# EAGLE design ESP8266_P10 (EAGLE 9.6.2)
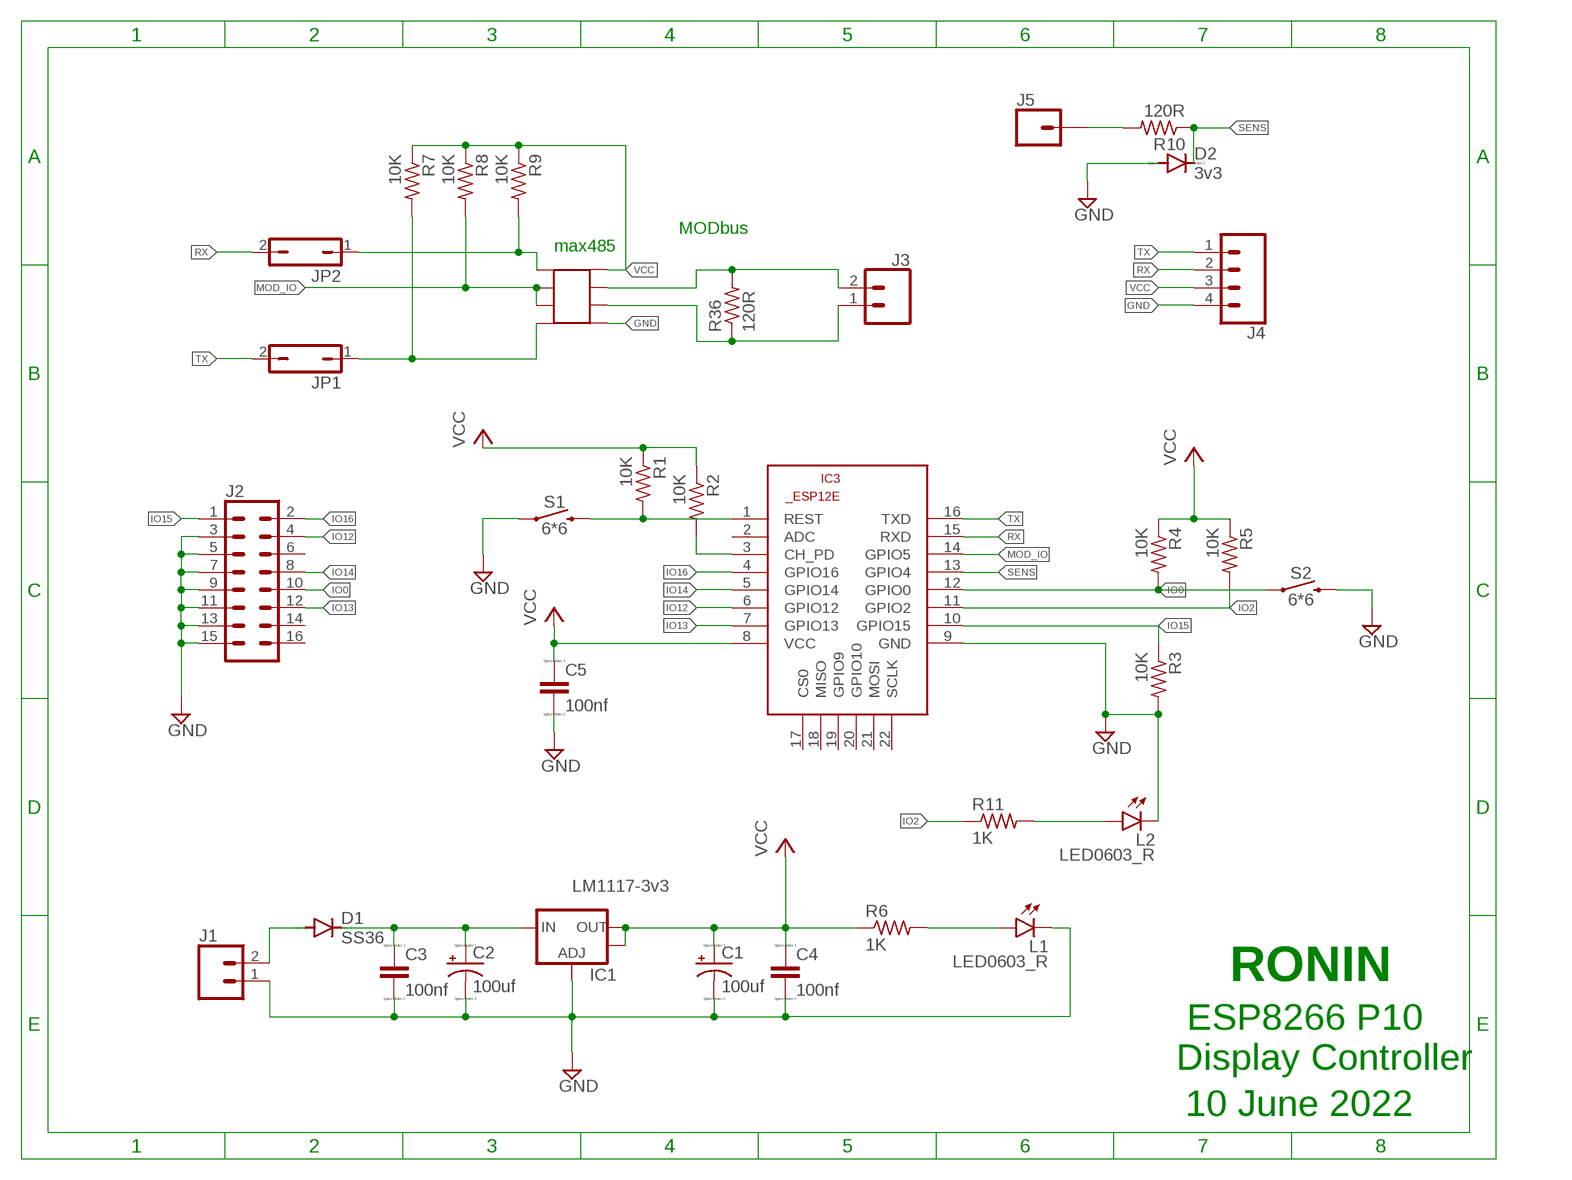
[diagram p0: schematic, sheet 1]

## Parts
C1  100uf  CAPACITOR_POLD  [PANASONIC_D]
C2  100uf  CAPACITOR_POLD  [PANASONIC_D]
C3  100nf  CAPACITOR_CER4  [C0603]
C4  100nf  CAPACITOR_CER4  [C0603]
C5  100nf  CAPACITOR_CER4  [C0603]
D1  SS36  DIODEAC2  [DO-214AC]
D2  3v3  DIODE80C  [SOD80C]
IC1  LM1117-3v3  V_REG_LM1117SOT223  [SOT223]
IC2  MAX485  SOP_8  [HSOP-8]
IC3  ESP8266-12EESP12E  [ESP8266-ESP12E]
J1  CONN_023.5MM  [SCREWTERMINAL-3.5MM-2]
J2  CONN_08X2  [2X8]
J3  CONN_023.5MM-NO_SILK  [SCREWTERMINAL-3.5MM-2-NS]
J4  CONN_04  [1X04]
J5  CONN_01  [1X01]
JP1  JP1Q  [JP1]
JP2  JP1Q  [JP1]
L1  LED0603_R  [0603_LED_GREEN]
L2  LED0603_R  [0603_LED_GREEN]
R1  10K  RESISTOR0603  [R0603]
R2  10K  RESISTOR0603  [R0603]
R3  10K  RESISTOR0603  [R0603]
R4  10K  RESISTOR0603  [R0603]
R5  10K  RESISTOR0603  [R0603]
R6  1K  RESISTOR0603  [R0603]
R7  10K  RESISTOR0603  [R0603]
R8  10K  RESISTOR0603  [R0603]
R9  10K  RESISTOR0603  [R0603]
R10  120R  RESISTOR0603  [R0603]
R11  1K  RESISTOR0603  [R0603]
R36  120R  RESISTOR0603  [R0603]
S1  6*6  MOMENTARY-SWITCH-SPST-PTH-6.0MM  [TACTILE_SWITCH_PTH_6.0MM]
S2  6*6  MOMENTARY-SWITCH-SPST-PTH-6.0MM  [TACTILE_SWITCH_PTH_6.0MM]

## Nets
CV: IC2.4 JP1.1 R7.2
FV: IC2.1 JP2.1 R9.2
GND: C1.- C2.- C3.2 C4.2 C5.2 D2.A IC1.1(ADJ) IC2.5 IC3.9(GND) J1.1 J2.3 J2.5 J2.7 J2.9 J2.11 J2.13 J2.15 J4.4 L1.C L2.C R3.2 S1.1 S2.3
IO0: IC3.12(GPIO0) J2.10 R4.2 S2.1
IO2: IC3.11(GPIO2) R5.2 R11.1
IO12: IC3.6(GPIO12) J2.4
IO13: IC3.7(GPIO13) J2.12
IO14: IC3.5(GPIO14) J2.8
IO15: IC3.10(GPIO15) J2.1 R3.1
IO16: IC3.4(GPIO16) J2.2
MOD_IO: IC2.2 IC2.3 IC3.14(GPIO5) R8.2
N$1: IC3.1(REST) R1.2 S1.3
N$2: IC3.3(CH_PD) R2.2
N$3: C2.+ C3.1 D1.C IC1.3(IN)
N$5: L1.A R6.2
N$6: J5.1 R10.2
N$10: L2.A R11.2
N$11: D1.A J1.2
N$17: IC2.7 J3.2 R36.2
N$18: IC2.6 J3.1 R36.1
RX: IC3.15(RXD) J4.2 JP2.2
SENS: D2.C IC3.13(GPIO4) R10.1
TX: IC3.16(TXD) J4.1 JP1.2
VCC: C1.+ C4.1 C5.1 IC1.2(OUT) IC1.4(OUT) IC2.8 IC3.8(VCC) J4.3 R1.1 R2.1 R4.1 R5.1 R6.1 R7.1 R8.1 R9.1
Unconnected: IC3.2(ADC) IC3.17(CS0) IC3.18(MISO) IC3.19(GPIO9) IC3.20(GPIO10) IC3.21(MOSI) IC3.22(SCLK) J2.6 J2.14 J2.16

## Notes on the sheet
- MODbus
- max485
- RONIN
- ESP8266 P10 
  Display Controller
- 10 June 2022

## Library data of the parts
C1 C2 = pasif_com1:CAPACITOR_POL
C3-C5 = pasif_com1:CAPACITOR_CER
D1 D2 = pasif_com1:DIODE
IC1 = SparkFun:V_REG_LM1117: Voltage Regulator LM1117 Standard adjustable voltage regulator but in SMD form. Spark Fun Electronics SKU : COM-00595
IC2 = sop_8:SOP_8
IC3 = esp12e:ESP8266-12E: ESP8266-12E Library for Eagle CAD The author not responsible for any damages or errors!. Created by Suhail jr.lt;/author>
J1 J3 = SparkFun-Connectors:CONN_02: Multi connection point. Often used as Generic Header-pin footprint for 0.1 inch spaced/style header connections On any of the 0.1 inch spaced packages, you can populate with these: Break Away Headers - Straight <https://www.sparkfun.com/products/116> (PRT-00116) Break Away Male Headers - Right Angle <https://www.sparkfun.com/products/553> (PRT-00553) Female Headers <https://www.sparkfun.com/products/115> (PRT-00115) Break Away Headers - Machine Pin <https://www.sparkfun.com/products/117> (PRT-00117) Break Away Female Headers - Swiss Machine Pin <https://www.sparkfun.com/products/743> (PRT-00743) For SCREWTERMINALS and SPRING TERMINALS visit here: Screw Terimnals on SparkFun.com <https://www.sparkfun.com/search/results?term=Screw+Terminals> (5mm/3.5mm/2.54mm spacing) This device is also useful as a general connection point to wire up your design to another part of your project. Our various solder wires solder well into these plated through hole pads. Hook-Up Wire - Assortment (Stranded, 22 AWG) <https://www.sparkfun.com/products/11375> (PRT-11375) Hook-Up Wire - Assortment (Solid Core, 22 AWG) <https://www.sparkfun.com/products/11367> (PRT-11367) View the entire wire category on our website here <https://www.sparkfun.com/categories/141> Special notes: Molex polarized connector foot print use with: PRT-08233 with associated crimp pins and housings. 2.54_SCREWTERM for use with PRT-10571. 3.5mm Screw Terminal footprints for PRT-08084 5mm Screw Terminal footprints for use with PRT-08432; PROD_ID: CONN-08399
J2 = SparkFun-Connectors:CONN_08X2: Multi connection point. Often used as Generic Header-pin footprint for 0.1 inch spaced/style header connections You can populate with any combo of single row headers, but if you'd like an exact match, check this: Header - 2x8 (Male, 0.1") <https://www.sparkfun.com/products/13156> (PRT-13156) On any of the 0.1 inch spaced packages, you can populate with these: Break Away Headers - Straight <https://www.sparkfun.com/products/116> (PRT-00116) Break Away Male Headers - Right Angle <https://www.sparkfun.com/products/553> (PRT-00553) Female Headers <https://www.sparkfun.com/products/115> (PRT-00115) Break Away Headers - Machine Pin <https://www.sparkfun.com/products/117> (PRT-00117) Break Away Female Headers - Swiss Machine Pin <https://www.sparkfun.com/products/743> (PRT-00743)
J4 = SparkFun-Connectors:CONN_04: Multi connection point. Often used as Generic Header-pin footprint for 0.1 inch spaced/style header connections On any of the 0.1 inch spaced packages, you can populate with these: Break Away Headers - Straight <https://www.sparkfun.com/products/116> (PRT-00116) Break Away Male Headers - Right Angle <https://www.sparkfun.com/products/553> (PRT-00553) Female Headers <https://www.sparkfun.com/products/115> (PRT-00115) Break Away Headers - Machine Pin <https://www.sparkfun.com/products/117> (PRT-00117) Break Away Female Headers - Swiss Machine Pin <https://www.sparkfun.com/products/743> (PRT-00743) For SCREWTERMINALS and SPRING TERMINALS visit here: Screw Terimnals on SparkFun.com <https://www.sparkfun.com/search/results?term=Screw+Terminals> (5mm/3.5mm/2.54mm spacing) This device is also useful as a general connection point to wire up your design to another part of your project. Our various solder wires solder well into these plated through hole pads. Hook-Up Wire - Assortment (Stranded, 22 AWG) <https://www.sparkfun.com/products/11375> (PRT-11375) Hook-Up Wire - Assortment (Solid Core, 22 AWG) <https://www.sparkfun.com/products/11367> (PRT-11367) View the entire wire category on our website here <https://www.sparkfun.com/categories/141> Special notes: Molex polarized connector foot print use with SKU : PRT-08231 with associated crimp pins and housings. 1MM SMD Version SKU: PRT-10208; PROD_ID: CONN-09696
J5 = SparkFun-Connectors:CONN_01: Single connection point. Often used as Generic Header-pin footprint for 0.1 inch spaced/style header connections On any of the 0.1 inch spaced packages, you can populate with these: Break Away Headers - Straight <https://www.sparkfun.com/products/116> (PRT-00116) Break Away Male Headers - Right Angle <https://www.sparkfun.com/products/553> (PRT-00553) Female Headers <https://www.sparkfun.com/products/115> (PRT-00115) Break Away Headers - Machine Pin <https://www.sparkfun.com/products/117> (PRT-00117) Break Away Female Headers - Swiss Machine Pin <https://www.sparkfun.com/products/743> (PRT-00743) This device is also useful as a general connection point to wire up your design to another part of your project. Our various solder wires solder well into these plated through hole pads. Hook-Up Wire - Assortment (Stranded, 22 AWG) <https://www.sparkfun.com/products/11375> (PRT-11375) Hook-Up Wire - Assortment (Solid Core, 22 AWG) <https://www.sparkfun.com/products/11367> (PRT-11367) View the entire wire category on our website here <https://www.sparkfun.com/categories/141> Special notes: SMTSO-256-ET is a "flush mount" nut for a 4-40 screw. We mostly use this on specialty testbeds; it is a nice way to connect hardware to your PCB at an adjustable hieght. Also note, the SNAP packages are for using a snappable style connector. We sell a baggie of snaps and they are also used on two LilyPad designs: Snap Assortment - 30 pack (male and female) <https://www.sparkfun.com/products/11347> (DEV-11347) LilyPad Arduino SimpleSnap <https://www.sparkfun.com/products/10941> (DEV-10941) LilyPad SimpleSnap Protoboard <https://www.sparkfun.com/products/10940> (DEV-10940)
JP1 JP2 = jumper:JP1Q: JUMPER
L1 L2 = pasif_com1:LED
R1-R11 R36 = pasif_com1:RESISTOR
S1 S2 = SparkFun-Switches:MOMENTARY-SWITCH-SPST: Momentary Switch (Pushbutton) - SPST Normally-open (NO) SPST momentary switches (buttons, pushbuttons). Variants PTH-12MM - 12mm square, through-hole Momentary Pushbutton Switch - 12mm Square <https://www.sparkfun.com/products/9190> (COM-09190) PTH-6.0MM, PTH-6.0MM-KIT - 6.0mm square, through-hole Mini Pushbutton Switch <https://www.sparkfun.com/products/97> (COM-00097) KIT package intended for soldering kit's - only one side of pads' copper is exposed. PTH-RIGHT-ANGLE-KIT - Right-angle, through-hole Right Angle Tactile Button <https://www.sparkfun.com/products/10791> - Used on SparkFun BigTime Watch Kit <https://www.sparkfun.com/products/11734> SMD-12MM - 12mm square, surface-mount Tactile Button - SMD (12mm) <https://www.sparkfun.com/products/12993> (COM-12993) Used on SparkFun PicoBoard <https://www.sparkfun.com/products/11888> SMD-4.5MM - 4.5mm Square Trackball Switch Used on SparkFun Blackberry Trackballer Breakout <https://www.sparkfun.com/products/13169> SMD-4.6MMX2.8MM - 4.60mm x 2.80mm, surface mount Used on SparkFun SAMD21 Mini Breakout <https://www.sparkfun.com/products/13664> SMD-5.2MM, SMD-5.2-REDUNDANT - 5.2mm square, surface-mount Mini Pushbutton Switch - SMD <https://www.sparkfun.com/products/8720> (COM-08720) Used on Arduino Pro Mini <https://www.sparkfun.com/products/11114> REDUNDANT package connects both switch circuits together SMD-6.0X3.5MM - 6.0 x 3.5mm, surface mount Momentary Reset Switch SMD <https://www.sparkfun.com/products/8229> (COM-08229) SMD-6.2MM-TALL - 6.2mm square, surface mount Tactile Button - SMD (6mm) <https://www.sparkfun.com/products/12992> Used on SparkFun Digital Sandbox <https://www.sparkfun.com/products/12651> SMD-RIGHT-ANGLE - Right-angle, surface mount Used on SparkFun Block for Intel® Edison - Arduino <https://www.sparkfun.com/products/13036>; PROD_ID: SWCH-08441; SF_SKU: COM-00097

## Board
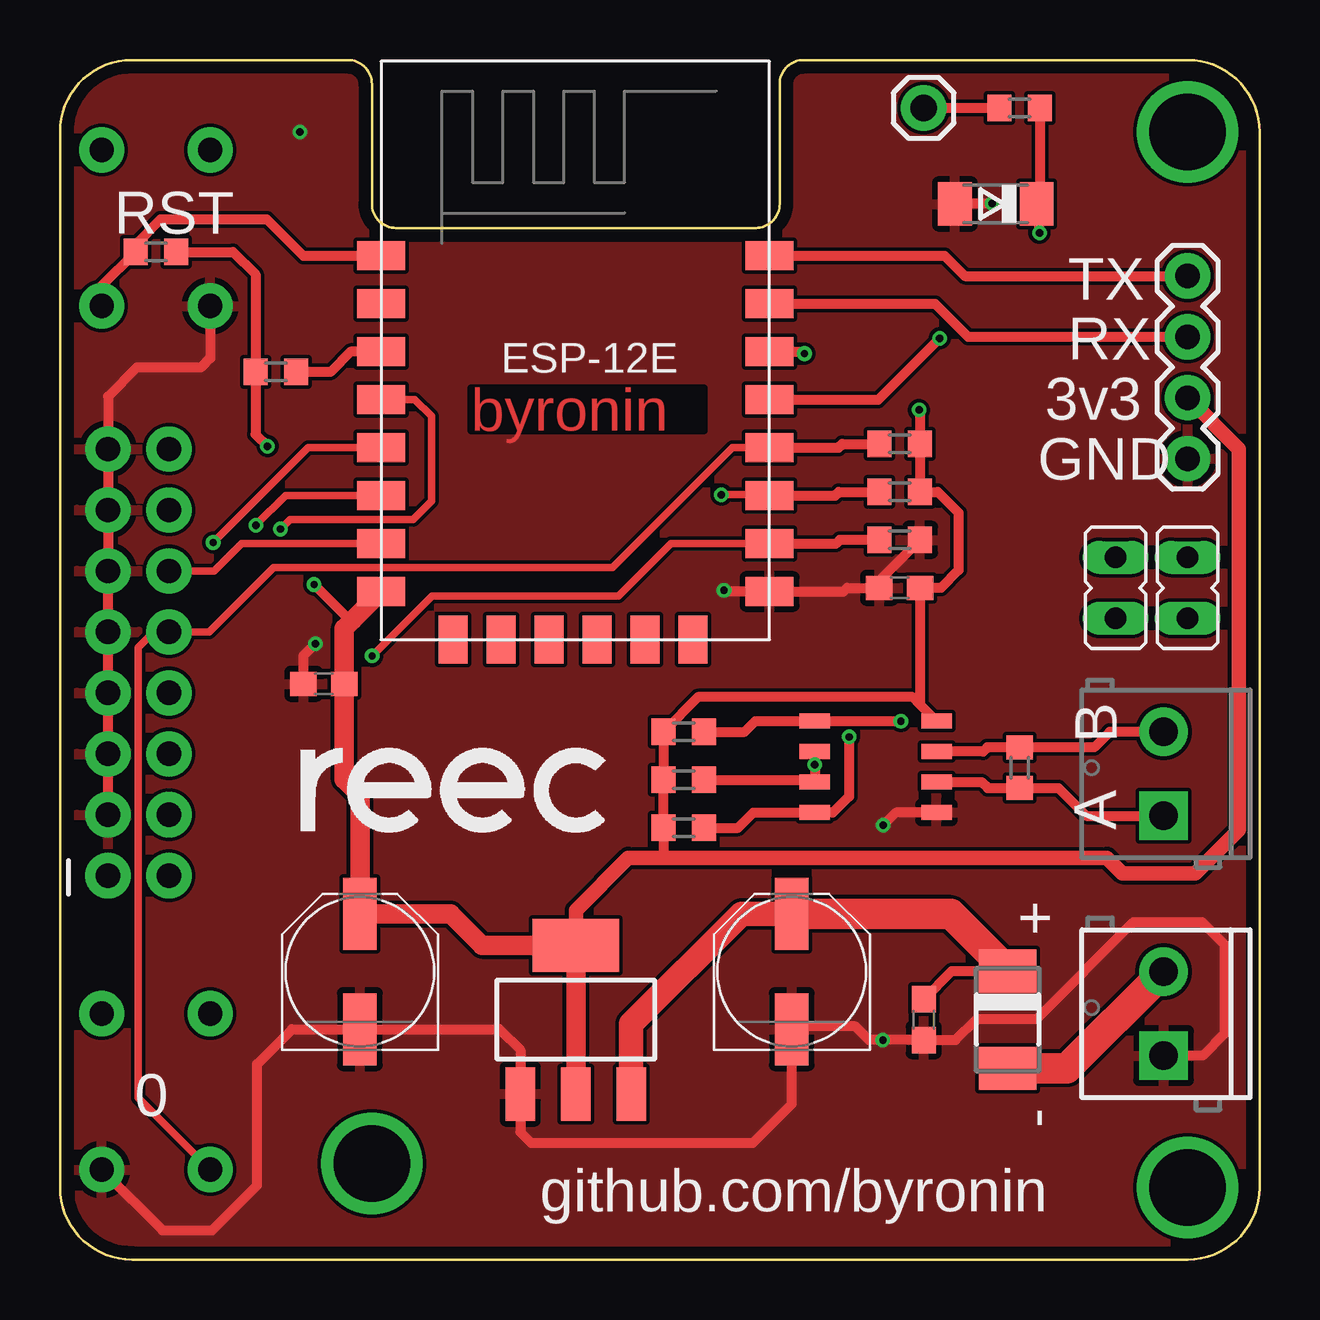
[diagram p1: board, top side]
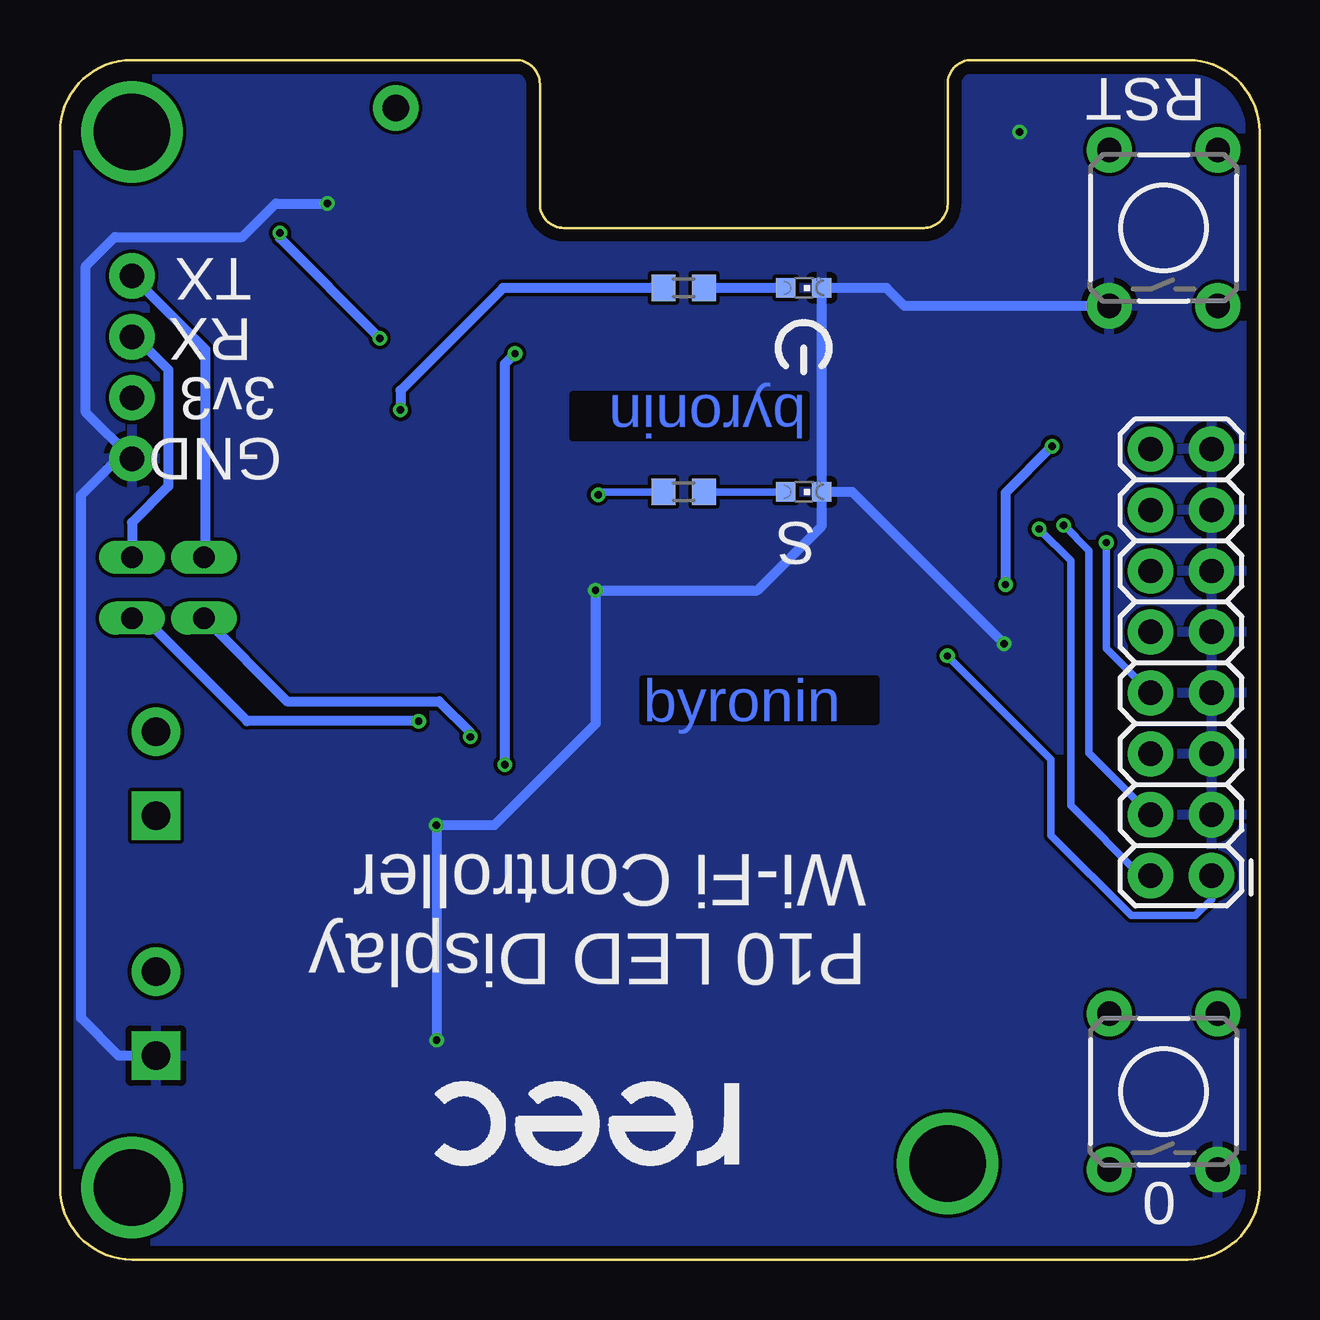
[diagram p2: board, bottom side, seen from below]

Size 50 x 50 mm. Coordinates in mm from the lower left corner, seen from the top.
Outline: 0,3 arc90 3,0 47,0 arc90 50,3 50,47 arc90 47,50 31,50 arc90 30,49 30,44 arc-90 29,43 14,43 arc-90 13,44 13,49 arc90 12,50 3,50 arc90 0,47 0,3
Copper layers (1*16): Top 0.035mm / dielectric 1.6mm / Bottom 0.035mm
Design rules "Elecrow_2-layer_PCB_eagle_rule": minimum track width 6mil, minimum drill 12mil, track to track 6mil, track to pad 6mil, pad to pad 6mil, via to via 8mil, smd to smd 0mil, copper to edge 20mil, drill to drill 10mil, minimum pad ring 6mil, minimum via ring 6mil, stop-mask expansion 0mil, vias tented up to drill 100mil, thermal gap 10mil

### Footprints (pad centres in the part's own frame; a part is rotated, then mirrored left to right if it is on the bottom)
PANASONIC_D = smd 3 x 1.4: + 2.4,0; - -2.4,0
C0603 = smd 1.1 x 1: 1 -0.85,0; 2 0.85,0
DO-214AC = smd 1.8 x 2.4: A 2.025,0; C -2.025,0
SOD80C = smd 1.4 x 1.8: A 1.7,0; C -1.7,0
SOT223 = smd 1.219 x 2.235: 1 -2.311,-3.099; 2 0,-3.099; 3 2.311,-3.099 | smd 3.6 x 2.2: 4 0,3.099
HSOP-8 = smd 1.27 x 0.635: 1 -2.54,1.945; 2 -2.54,0.675; 3 -2.54,-0.595; 4 -2.54,-1.865; 5 2.54,-1.865; 6 2.54,-0.595; 7 2.54,0.675; 8 2.54,1.945
ESP8266-ESP12E = smd 2 x 1.2: 1 -7.62,5.84; 2 -7.62,3.84; 3 -7.62,1.84; 4 -7.62,-0.16; 5 -7.62,-2.16; 6 -7.62,-4.16; 7 -7.62,-6.16; 8 -7.62,-8.16; 9 8.58,-8.16; 10 8.58,-6.16; 11 8.58,-4.16; 12 8.58,-2.16; 13 8.58,-0.16; 14 8.58,1.84; 15 8.58,3.84; 16 8.58,5.84 | smd 1.2 x 2: 17 -4.62,-10.16; 18 -2.62,-10.16; 19 -0.62,-10.16; 20 1.38,-10.16; 21 3.38,-10.16; 22 5.38,-10.16
SCREWTERMINAL-3.5MM-2 = drill 1.2 pad 2.032 square: 1 0,0 | drill 1.2 pad 2.032: 2 3.5,0
2X8 = drill 1.016 pad 1.88: 1 0,0; 2 0,2.54; 3 2.54,0; 4 2.54,2.54; 5 5.08,0; 6 5.08,2.54; 7 7.62,0; 8 7.62,2.54; 9 10.16,0; 10 10.16,2.54; 11 12.7,0; 12 12.7,2.54; 13 15.24,0; 14 15.24,2.54; 15 17.78,0; 16 17.78,2.54
SCREWTERMINAL-3.5MM-2-NS = drill 1.2 pad 2.032 square: 1 0,0 | drill 1.2 pad 2.032: 2 3.5,0
1X04 = drill 1.016 pad 1.88: 1 0,0; 2 2.54,0; 3 5.08,0; 4 7.62,0
1X01 = drill 1.092 pad 1.88: 1 0,0
JP1 = drill 0.914 long: 1 0,-1.27; 2 0,1.27
0603_LED_GREEN = smd 0.8 x 0.8: A 0,-0.75; C 0,0.75
R0603 = smd 1 x 1.1: 1 -0.85,0; 2 0.85,0
TACTILE_SWITCH_PTH_6.0MM = drill 1.016 pad 1.88: 1 -3.251,2.261; 2 3.251,2.261; 3 -3.251,-2.261; 4 3.251,-2.261

### Placement (x,y rotation side)
C1  12.5,12 90 top
C2  30.5,12 90 top
C3  36,10 270 top
C4  11,24 180 top
C5  35,28 180 top
D1  39.5,10 270 top
D2  39,44 180 top
IC1  21.5,10 0 top
IC2  34,20.5 0 top
IC3  21,36 0 top
J1  46,8.5 90 top
J2  2,16 90 bottom
J3  46,18.5 90 top
J4  47,41 270 top
J5  36,48 0 top
JP1  44,28 0 top
JP2  47,28 0 top
L1  19,40.5 270 bottom
L2  19,32 270 bottom
R1  4,42 180 top
R2  9,37 0 top
R3  35,30 0 top
R4  35,34 180 top
R5  35,32 180 top
R6  24,40.5 0 bottom
R7  26,18 0 top
R8  26,20 0 top
R9  26,22 0 top
R10  40,48 180 top
R11  24,32 0 bottom
R36  40,20.5 90 top
S1  4,43 90 bottom
S2  4,7 90 bottom

### Tracks (layer width: path | path; a pad name or v marks a point on that pad's centre or on a via)
CV  (via drill 0.3)
  Top 0.406: R7.2 28.27,18 28.9,18.64 IC2.4 31.47,18.63 32.22,18.63 32.89,19.3 v32.89,21.79
  Bottom 0.406: JP1.1 40.54,23.27 34.19,23.27 32.89,21.96 v32.89,21.79
FV  (via drill 0.3)
  Top 0.406: R9.2 28.54,22 28.98,22.45 IC2.1 v35.05,22.45 v35.05,22.44
  Bottom 0.406: v35.05,22.44 42.2,22.44 46.49,26.73 JP2.1
GND  (via drill 0.3)
  Top 0.406: R3.2 34.15,28.3 C5.2 32.81,28 32.65,27.84 IC3.9 27.73,27.84 v27.68,27.89 | J2.3 J2.5 J2.7 J2.9 J2.11 J2.13 J2.15 2,35.98 3.2,37.18 5.88,37.18 6.26,37.57 S1.1 | C4.2 10.15,25.17 v10.65,25.67 | IC2.5 34.85,18.64 v34.31,18.1 | v38.85,44.02 37.31,44.02 D2.A | S2.3 4.27,1.22 6.34,1.22 8.21,3.09 8.21,8.14 9.67,9.6 C1.- 18.32,9.6 19.19,8.73 IC1.1 19.19,5.31 19.64,4.86 28.88,4.86 30.5,6.48 C2.- 30.61,9.71 33.16,9.71 33.72,9.15 v34.3,9.15 C3.2 37.33,9.15 38.22,10.04 40.72,10.04 44.75,14.07 47.6,14.07 48.53,13.14 48.53,9.4 47.63,8.5 J1.1
  Bottom 0.406: L2.C L1.C 15.55,40.5 14.79,39.75 S1.1 | v10.65,25.67 16.98,32 L2.C | L2.C 18.25,30.57 20.93,27.89 v27.68,27.89 27.68,22.33 31.91,18.1 v34.31,18.1 v34.31,9.16 v34.3,9.15 | J1.1 47.56,8.5 49.12,10.06 49.12,31.86 47.6,33.38 J4.4 48.92,35.3 48.92,41.41 47.72,42.62 42.41,42.62 41.01,44.02 v38.85,44.02
  other vias: 10,47
  pour Top: -1,47 arc-90 3,51 12,51 arc-90 14,49 14,45 arc90 15,44 28,44 arc90 29,45 29,49 arc-90 31,51 47,51 arc-90 51,47 51,3 arc-90 47,-1 3,-1 arc-90 -1,3
  pour Bottom: 3,51 12,51 arc-90 14,49 14,45 arc90 15,44 28,44 arc90 29,45 29,49 arc-90 31,51 47,51 arc-90 51,47 51,3 arc-90 47,-1 3,-1 arc-90 -1,3 -1,47 arc-90
IO0
  Top 0.305: IC3.12 28.03,33.84 23.03,28.85 8.9,28.85 6.22,26.16 J2.10 3.92,26.16 3.26,25.51 3.26,6.75 S2.1
  Top 0.406: IC3.12 32.45,33.84 32.61,34 R4.2
IO2  (via drill 0.3)
  Top 0.305: v27.56,31.88 29.54,31.88 IC3.11
  Top 0.406: IC3.11 32.31,31.84 32.47,32 R5.2
  Bottom 0.305: R11.1 27.44,32 v27.56,31.88
IO12  (via drill 0.3)
  Top 0.305: IC3.6 9.4,31.84 v8.16,30.61
  Bottom 0.305: v8.16,30.61 7.12,29.56 7.12,21.12 J2.4
IO13
  Top 0.305: IC3.7 7.57,29.84 6.43,28.7 J2.12
IO14  (via drill 0.3)
  Top 0.305: IC3.5 10.34,33.84 v6.39,29.89
  Bottom 0.305: v6.39,29.89 6.39,25.47 J2.8
IO15  (via drill 0.3)
  Top 0.305: IC3.10 25.47,29.84 23.28,27.66 15.5,27.66 v13.01,25.16
  Top 0.406: R3.1 32.51,30 32.34,29.83 IC3.10
  Bottom 0.305: v13.01,25.16 8.69,20.84 8.69,17.68 5.35,14.34 2.67,14.34 2,15.01 J2.1
IO16  (via drill 0.3)
  Top 0.305: IC3.4 14.79,35.84 15.48,35.15 15.48,31.61 14.72,30.85 9.59,30.85 v9.19,30.45
  Bottom 0.305: v9.19,30.45 7.87,29.13 7.87,18.93 4.94,16 J2.2
MOD_IO  (via drill 0.3)
  Top 0.406: R8.2 31.36,20 | 31.36,20 IC2.3 | IC2.2 v31.46,20.63 31.46,20.09 31.36,20 | IC3.14 30.36,37.84 30.37,37.83 31.03,37.83 v31.03,37.76
  Bottom 0.406: v31.03,37.76 31.46,37.33 v31.46,20.63
N$1
  Top 0.406: S1.3 1.74,40.59 R1.2 3.15,42.31 4.19,43.35 8.62,43.35 10.14,41.84 IC3.1
N$2
  Top 0.406: IC3.3 12.11,37.84 11.27,37 R2.2
N$3
  Top 0.406: C3.1 37.17,12.03 D1.C
  Top 1.016: IC1.3 23.81,9.81 28.4,14.4 C2.+
  Top 1.27: D1.C 37.12,14.4 C2.+
N$4  (via drill 3.2)
  other vias: 47,3
N$5
  Bottom 0.406: L1.A R6.2
N$6
  Top 0.406: R10.2 J5.1
N$8  (via drill 3.2)
  other vias: 13,4
N$9  (via drill 3.2)
  other vias: 47,47
N$10
  Bottom 0.305: L2.A R11.2
N$11
  Top 1.27: J1.2 41.97,7.97 D1.A
N$17
  Top 0.406: J3.2 43.76,22 43.11,21.35 R36.2 38.65,21.35 38.47,21.18 IC2.7
N$18
  Top 0.406: IC2.6 38.42,19.91 38.67,19.65 R36.1 41.62,19.65 42.77,18.5 J3.1
RX
  Top 0.406: IC3.15 36.47,39.84 37.85,38.46 J4.2
  Bottom 0.406: J4.2 46.86,38.46 45.48,37.09 45.48,32.23 47,30.72 JP2.2
SENS  (via drill 0.3)
  Top 0.406: IC3.13 34.11,35.84 v36.67,38.4 | v40.83,42.79 40.83,43.87 D2.C 40.85,44.15 R10.1
  Bottom 0.406: v36.67,38.4 40.83,42.56 v40.83,42.79
TX
  Top 0.406: IC3.16 36.87,41.84 37.71,41 J4.1
  Bottom 0.406: JP1.2 43.93,29.34 43.93,37.93 J4.1
VCC  (via drill 0.3)
  Top 0.406: 25.06,16.74 25.15,16.83 R7.1 R8.1 R9.1 26.59,23.44 35.55,23.44 35.85,23.14 | 35.85,23.14 C5.1 36.72,28 37.46,28.73 37.46,31.13 36.59,32 R5.1 R4.1 35.85,35.37 v35.81,35.41 | 35.85,23.14 IC2.8 | R1.1 7.21,42 8.15,41.06 R2.1 8.15,34.39 v8.65,33.9 | v10.59,28.14 12.07,26.66 12.19,26.66
  Top 0.61: IC1.4 21.5,14.56 23.68,16.74 25.06,16.74 43.64,16.74 44.29,16.1 47.33,16.1 49.14,17.91 49.14,33.78 J4.3
  Top 0.813: IC1.2 IC1.4 17.59,13.1 16.29,14.4 C1.+ 12.5,19.35 11.85,20 C4.1 11.85,26.31 12.19,26.66 IC3.8
  Bottom 0.406: v8.65,33.9 10.59,31.95 v10.59,28.14 | R6.1 31.53,40.5 35.81,36.23 v35.81,35.41

### Text on the board
Top: byronin
Bottom: byronin | byronin
tPlace: RST | TX | RX | 3v3 | GND | B | A | + | 0 | - | github.com/byronin
bPlace: RST | TX | RX | 3v3 | GND | S | P10 LED Display / Wi-Fi Controller | 0